# Altium schematic sheet pOWER.SchDoc
size A4
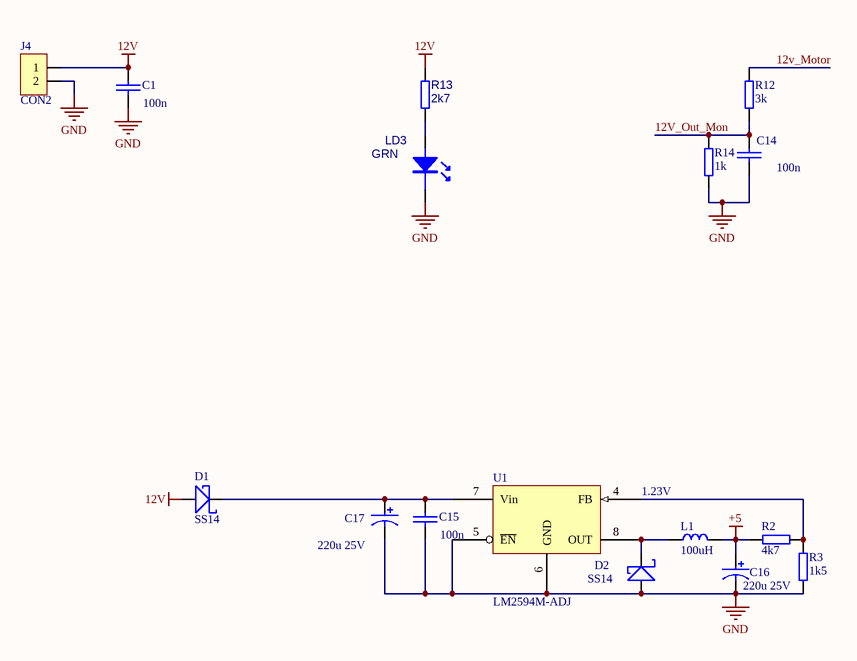
[diagram p0: pOWER.SchDoc]

## Parts
C1  100n  [0603]
C14  100n  [0603]
C15  100n  [0603]
C16  220u 25V  [RB.15/.32]
C17  220u 25V  [RB.15/.32]
D1  SS14  [DO-214AC]
D2  SS14  [DO-214AC]
J4  CON2  [WEID2R]
L1  100uH  [INDUCTOR6B]
LD3  GRN  [0805DIODE]
R2  4k7  [0603]
R3  1k5  [0603]
R12  3k  [0603]
R13  2k7  [0603]
R14  1k  [0603]
U1  LM2594M-ADJ  [M08A_N]

## Nets
12V: C1.2 D1.A J4.1 R13.1
+5: C16.1 L1.2 R2.2
GND: C1.1 C14.1 C15.1 C16.2 C17.2 D2.A J4.2 LD3.K R3.1 R14.1 U1.5(~{EN}) U1.6(GND)
12v_Motor: R12.2
12V_Out_Mon: C14.2 R12.1 R14.2
NetC15_2: C15.2 C17.1 D1.K U1.7(Vin)
NetD2_K: D2.K L1.1 U1.8(OUT)
NetLD3_A: LD3.A R13.2
NetR2_1: R2.1 R3.2 U1.4(FB)

## Notes on the sheet
- 1.23V

## Library data of the parts
C1 C14 C15 = CAP
C16 C17 = CAPACITOR POL-S
D1 D2 = DIODE SCHOTTKY-S
L1 = INDUCTOR6
LD3 = LED
R2 R3 = RES-AX0.3
R12-R14 = RES8
U1 = LM2594